# EAGLE design serial_to_usb_interface_0.2 (EAGLE 6.5.3)
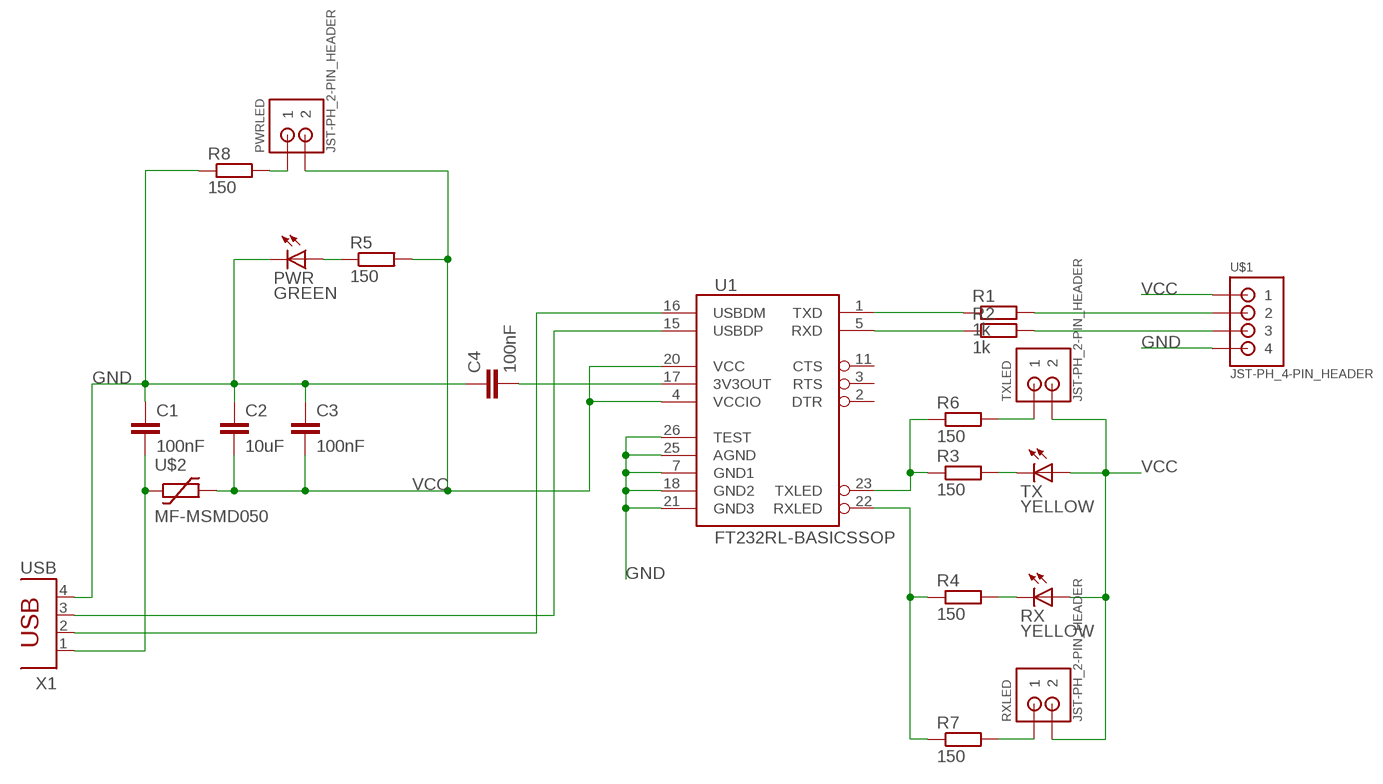
[diagram p0: schematic, sheet 1]

## Parts
C1  100nF  C-EUC1206  [C1206]
C2  10uF  C-EUC1206  [C1206]
C3  100nF  C-EUC1206  [C1206]
C4  100nF  C-EUC1206  [C1206]
PWR  GREEN  LEDCHIPLED_0805  [CHIPLED_0805]
PWRLED  JST-PH_2-PIN_HEADER  [JST_B2B-PH_HEADER]
R1  1k  R-EU_R1206  [R1206]
R2  1k  R-EU_R1206  [R1206]
R3  150  R-EU_R1206  [R1206]
R4  150  R-EU_R1206  [R1206]
R5  150  R-EU_R1206  [R1206]
R6  150  R-EU_R1206  [R1206]
R7  150  R-EU_R1206  [R1206]
R8  150  R-EU_R1206  [R1206]
RX  YELLOW  LEDCHIPLED_0805  [CHIPLED_0805]
RXLED  JST-PH_2-PIN_HEADER  [JST_B2B-PH_HEADER]
TX  YELLOW  LEDCHIPLED_0805  [CHIPLED_0805]
TXLED  JST-PH_2-PIN_HEADER  [JST_B2B-PH_HEADER]
U1  FT232RL-BASICSSOP  [SSOP28DB]
U$1  JST-PH_4-PIN_HEADER  [JST_B4B-PH_HEADER]
U$2  MF-MSMD050  [MF-MSMD050]
X1  USB  PN87520  [PN87520]

## Nets
GND: C1.1 C2.1 C3.1 C4.1 PWR.C R8.1 U1.7(GND1) U1.18(GND2) U1.21(GND3) U1.25(AGND) U1.26(TEST) U$1.P4 X1.4
N$2: R4.2 RX.C
N$3: R3.1 R6.1 U1.23(TXLED)
N$4: C4.2 U1.17(3V3OUT)
N$5: U1.15(USBDP) X1.3
N$6: U1.16(USBDM) X1.2
N$7: C1.2 U$2.P$1 X1.1
N$8: R1.1 U1.1(TXD)
N$9: R2.1 U1.5(RXD)
N$10: R1.2 U$1.P2
N$11: R2.2 U$1.P3
N$12: R4.1 R7.1 U1.22(RXLED)
N$15: R3.2 TX.C
N$16: R7.2 RXLED.P1
N$17: PWR.A R5.1
PWRLED: PWRLED.P1 R8.2
TXLED: R6.2 TXLED.P1
VCC: C2.2 C3.2 PWRLED.P2 R5.2 RX.A RXLED.P2 TX.A TXLED.P2 U1.4(VCCIO) U1.20(VCC) U$1.P1 U$2.P$2
Unconnected: U1.2(DTR) U1.3(RTS) U1.11(CTS)

## Library data of the parts
C1-C4 = resistor:C-EU: CAPACITOR, European symbol
PWR RX TX = adafruit:LED: LED OSRAM: - CHIPLED LG R971, LG N971, LY N971, LG Q971, LY Q971, LO R971, LY R971 LH N974, LH R974 LS Q976, LO Q976, LY Q976 LO Q996 - Hyper CHIPLED LW Q18S LB Q993, LB Q99A, LB R99A - SideLED LS A670, LO A670, LY A670, LG A670, LP A670 LB A673, LV A673, LT A673, LW A673 LH A674 LY A675 LS A676, LA A676, LO A676, LY A676, LW A676 LS A679, LY A679, LG A679 - Hyper Micro SIDELED® LS Y876, LA Y876, LO Y876, LY Y876 LT Y87S - SmartLED LW L88C, LW L88S LB L89C, LB L89S, LG L890 LS L89K, LO L89K, LY L89K LS L896, LA L896, LO L896, LY L896 - TOPLED LS T670, LO T670, LY T670, LG T670, LP T670 LSG T670, LSP T670, LSY T670, LOP T670, LYG T670 LG T671, LOG T671, LSG T671 LB T673, LV T673, LT T673, LW T673 LH T674 LS T676, LA T676, LO T676, LY T676, LB T676, LH T676, LSB T676, LW T676 LB T67C, LV T67C, LT T67C, LS T67K, LO T67K, LY T67K, LW E67C LS E67B, LA E67B, LO E67B, LY E67B, LB E67C, LV E67C, LT E67C LW T67C LS T679, LY T679, LG T679 LS T770, LO T770, LY T770, LG T770, LP T770 LB T773, LV T773, LT T773, LW T773 LH T774 LS E675, LA E675, LY E675, LS T675 LS T776, LA T776, LO T776, LY T776, LB T776 LHGB T686 LT T68C, LB T68C - Hyper Mini TOPLED® LB M676 - Mini TOPLED Santana® LG M470 LS M47K, LO M47K, LY M47K Source: http://www.osram.convergy.de/
PWRLED RXLED TXLED = SRG:JST-PH_2-PIN_HEADER: 2-pin JST PH Shrouded Header, top entry P/N B2B-PH-K-S Mating connector PHR-2 Mating cable assembly: Sparkfun PRT-09914 <http://www.sparkfun.com/products/9914>
R1-R8 = resistor:R-EU_: RESISTOR, European symbol
U1 = SparkFun-DigitalIC:FT232RL-BASIC: USB UART This is the simplified version of the FT232RL unit. Only what you need, nothing you don't. Spark Fun Electronics SKU : COM-00650
U$1 = SRG:JST-PH_4-PIN_HEADER: 4-pin JST PH Shrouded Header, top entry P/N B4B-PH-K-S Mating connector PHR-4 Mating cable assembly: Sparkfun PRT-09916 <http://www.sparkfun.com/products/9916>
U$2 = ptc-littlefuse:MF-MSMD050
X1 = con-berg:PN87520: BERG USB connector; OC_FARNELL: unknown; OC_NEWARK: unknown

## Board
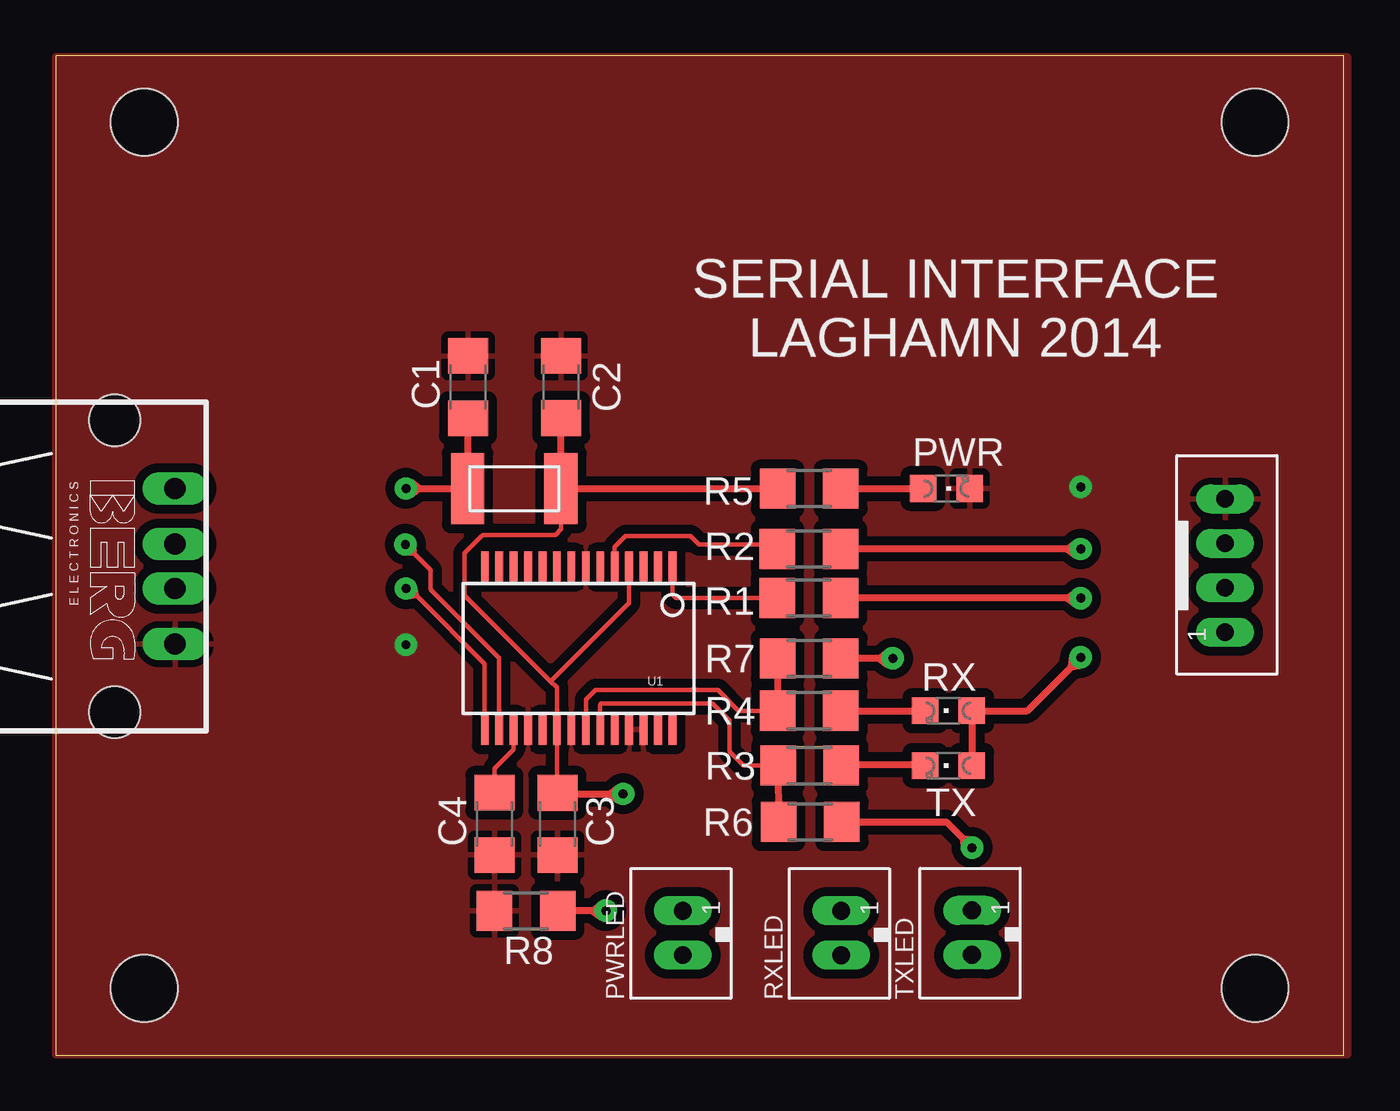
[diagram p1: board, top side]
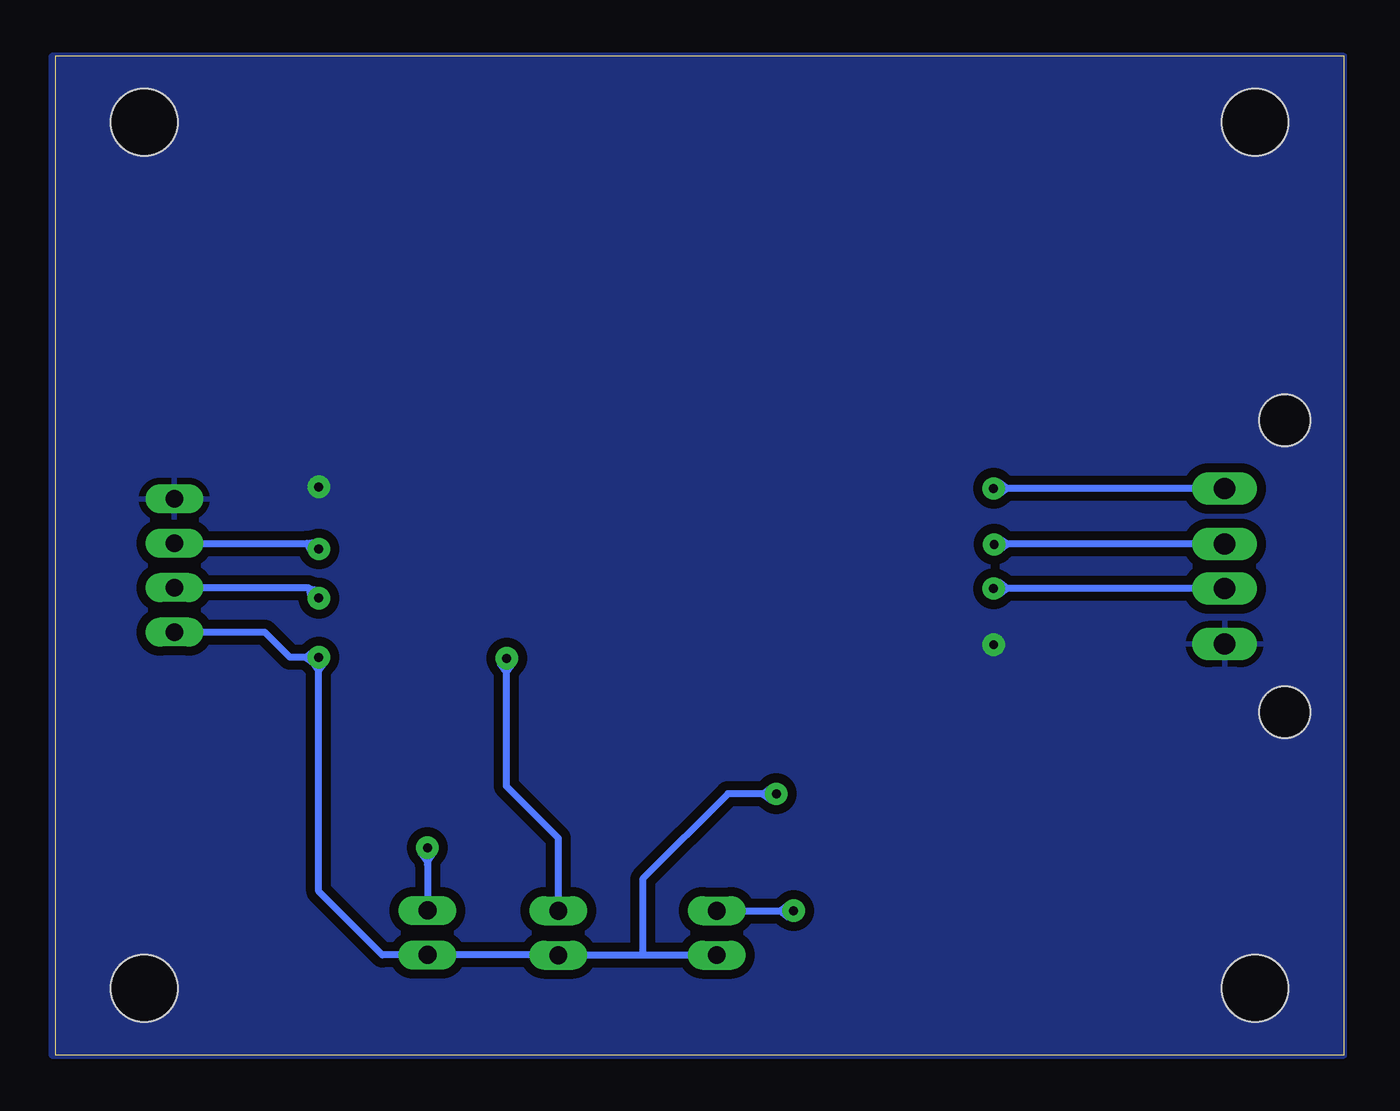
[diagram p2: board, bottom side, seen from below]

Size 58 x 45 mm. Coordinates in mm from the lower left corner, seen from the top.
Outline: 0,0 58,0 58,45 0,45 0,0
Copper layers (1*16): Top 0.035mm / dielectric 1.5mm / Bottom 0.035mm
Design rules "DesignRule *": minimum track width 8mil, minimum drill 0.5mm, track to track 16mil, track to pad 12mil, pad to pad 10mil, via to via 10mil, smd to smd 8mil, copper to edge 0mil, drill to drill 8mil, minimum pad ring 10mil, minimum via ring 12mil, stop-mask expansion 4mil, vias tented up to drill 0mil, thermal gap 12mil
Holes 3 mm at 4,3 4,42 54,42 54,3

### Footprints (pad centres in the part's own frame; a part is rotated, then mirrored left to right if it is on the bottom)
C1206 = smd 1.6 x 1.8: 1 -1.4,0; 2 1.4,0
CHIPLED_0805 = smd 1.2 x 1.2: A 0,-1.05; C 0,1.05
JST_B2B-PH_HEADER = drill 0.8 long: P1 1.075,0.048; P2 -0.925,0.048
R1206 = smd 1.6 x 1.803: 1 -1.422,0; 2 1.422,0
SSOP28DB = smd 0.348 x 1.397: 1 -4.225,-3.656; 2 -3.575,-3.656; 3 -2.925,-3.656; 4 -2.275,-3.656; 5 -1.625,-3.656; 6 -0.975,-3.656; 7 -0.325,-3.656; 8 0.325,-3.656; 9 0.975,-3.656; 10 1.625,-3.656; 11 2.275,-3.656; 12 2.925,-3.656; 13 3.575,-3.656; 14 4.225,-3.656; 15 4.225,3.656; 16 3.575,3.656; 17 2.925,3.656; 18 2.275,3.656; 19 1.625,3.656; 20 0.975,3.656; 21 0.325,3.656; 22 -0.325,3.656; 23 -0.975,3.656; 24 -1.625,3.656; 25 -2.275,3.656; 26 -2.925,3.656; 27 -3.575,3.656; 28 -4.225,3.656
JST_B4B-PH_HEADER = drill 0.8 long: P1 2.98,0.048; P2 0.98,0.048; P3 -1.02,0.048; P4 -3.02,0.048
MF-MSMD050 = smd 1.5 x 3.2: P$1 -2.1,0; P$2 2.1,0
PN87520 = drill 0.95 long: 1 -3.5,2.71; 2 -1,2.71; 3 1,2.71; 4 3.5,2.71 | hole 2.3: -6.57,0; 6.57,0

### Placement (x,y rotation side)
C1  18.56,30.07 270 top
C2  22.76,30.08 270 top
C3  22.59,10.4 90 top
C4  19.76,10.41 90 top
PWR  40.1,25.51 270 top
PWRLED  28.28,5.42 90 top
R1  33.92,20.58 0 top
R2  33.92,22.79 0 top
R3  33.95,13.03 0 top
R4  33.93,15.5 0 top
R5  33.92,25.5 180 top
R6  33.98,10.5 0 top
R7  33.93,17.86 0 top
R8  21.18,6.5 0 top
RX  40.19,15.5 90 top
RXLED  35.41,5.42 90 top
TX  40.19,13.03 90 top
TXLED  41.3,5.44 90 top
U1  23.55,18.31 180 top
U$1  52.6,22.02 270 top
U$2  20.65,25.5 0 top
X1  2.67,22 270 top

### Tracks (layer width: path | path; a pad name or v marks a point on that pad's centre or on a via)
GND  (via drill 0.4)
  other vias: 15.77,18.47 46.15,25.58
  pour Bottom (isolate 0.305): 0,45 58,45 58,0 0,0
  pour Top (isolate 0.305): 0,45 58,45 58,0 0,0
N$2
  Top 0.305: RX.C 39.12,15.49 35.43,15.49 R4.2
N$3
  Top 0.203: U1.23 24.51,14.68 24.51,15.77 24.56,15.82 29.57,15.82 30.33,15.06 30.33,13.66 30.96,13.03 R3.1
  Top 0.305: R3.1 R6.1
N$4
  Top 0.203: C4.2 19.76,12.9 20.62,13.76 U1.17
  Top 0.305: U1.17
N$5  (via drill 0.4)
  Top 0.203: v15.77,21.01 15.93,21.01 16.27,20.67 | 16.27,20.67 19.32,17.62 U1.15 | 16.27,20.67 16.16,21.1 v15.77,21.01 | 16.27,20.67 15.83,20.61 v15.77,21.01
  Bottom 0.203: v15.77,21 v15.77,21.01
  Bottom 0.305: X1.3 15.17,21 | 15.17,21 v15.77,21 | 15.17,21 15.57,20.72 v15.77,21.01 15.57,21.29 15.17,21
N$6  (via drill 0.4)
  Top 0.203: v15.75,22.99 16.17,22.56 | 16.17,22.56 16.89,21.84 16.89,20.95 19.97,17.88 U1.16 | 16.17,22.56 16.15,23.01 v15.75,22.99 | 16.17,22.56 15.73,22.58 v15.75,22.99
  Bottom 0.203: 15.77,23.01 15.77,23 15.75,23 v15.75,22.99
  Bottom 0.305: X1.2 15.15,23 | 15.15,23 15.75,23 | 15.15,23 15.53,22.71 v15.75,22.99 15.55,23.28 15.15,23
N$7  (via drill 0.4)
  Top 0.305: v15.78,25.51 16.38,25.51 | 16.38,25.51 U$2.P$1 18.56,25.5 C1.2 | 16.38,25.51 15.98,25.79 v15.78,25.51 | 16.38,25.51 15.98,25.22 v15.78,25.51
  Bottom 0.305: X1.1 15.18,25.5 | 15.18,25.5 v15.78,25.5 v15.78,25.51 | 15.18,25.5 15.57,25.22 v15.78,25.51 | 15.18,25.5 15.57,25.79 v15.78,25.51
N$8
  Top 0.203: R1.1 32.38,20.57 27.94,20.57 27.77,20.74 U1.1
N$9
  Top 0.203: R2.1 32.38,22.99 28.96,22.99 28.57,23.37 25.65,23.37 25.17,22.89 U1.5
N$10  (via drill 0.4)
  Top 0.305: v46.15,20.57 45.55,20.57 | 45.55,20.57 R1.2 | 45.55,20.57 45.95,20.29 v46.15,20.57 | 45.55,20.57 45.95,20.86 v46.15,20.57
  Bottom 0.305: U$1.P2 46.62,21.04 46.58,21 | 46.58,21 v46.15,20.57 | 46.58,21 46.1,20.92 v46.15,20.57 | 46.58,21 46.5,20.52 v46.15,20.57
N$11  (via drill 0.4)
  Top 0.203: R2.2
  Top 0.305: v46.15,22.78 45.55,22.78 | 45.55,22.78 R2.2 | 45.55,22.78 45.95,22.5 v46.15,22.78 | 45.55,22.78 45.95,23.07 v46.15,22.78
  Bottom 0.203: 46.41,23.04 v46.15,22.78
  Bottom 0.305: U$1.P3 46.69,23.04 | 46.69,23.04 46.41,23.04 | 46.69,23.04 46.22,23.13 v46.15,22.78 46.46,22.61 46.69,23.04
N$12
  Top 0.203: U1.22 23.88,14.68 23.88,16 24.31,16.43 29.82,16.43 30.75,15.5 R4.1
  Top 0.305: R7.1 32.51,17.78 32.51,15.62 R4.1
N$13
  pour Bottom: 0,0 0,44.96 58.17,44.96 58.17,0
N$14
  pour Top: 0,0 0,44.96 58.17,44.96 58.17,0
N$15
  Top 0.305: TX.C 39.12,13.08 35.43,13.08 R3.2
N$16  (via drill 0.4)
  Top 0.305: v37.69,17.86 37.09,17.86 | 37.09,17.86 36.94,17.86 | 36.94,17.86 R7.2 | 36.94,17.86 | 37.09,17.86 37.48,17.57 v37.69,17.86 | 37.09,17.86 37.48,18.14 v37.69,17.86
  Bottom 0.305: RXLED.P1 35.36,9.76 37.7,12.1 37.7,17.26 | 37.7,17.26 37.7,17.84 v37.69,17.86 | 37.7,17.26 37.98,17.66 v37.69,17.86 | 37.7,17.26 37.41,17.64 v37.69,17.86
N$17
  Top 0.305: R5.1 PWR.A
PWRLED  (via drill 0.4)
  Top 0.305: v24.77,6.5 24.18,6.5 | 24.18,6.5 24.02,6.5 | 24.02,6.5 R8.2 | 24.02,6.5 | 24.18,6.5 24.57,6.21 v24.77,6.5 | 24.18,6.5 24.57,6.78 v24.77,6.5
  Bottom 0.305: PWRLED.P1 25.38,6.5 | 25.38,6.5 25.16,6.5 v24.77,6.5 | 25.38,6.5 24.98,6.78 v24.77,6.5 | 25.38,6.5 24.98,6.21 v24.77,6.5
TXLED  (via drill 0.4)
  Top 0.305: R6.2 40.09,10.5 40.84,9.76 | 40.84,9.76 v41.26,9.33 | 40.84,9.76 40.91,9.28 v41.26,9.33 | 40.84,9.76 41.31,9.68 v41.26,9.33
  Bottom 0.305: v41.26,9.33 41.26,8.73 | 41.26,8.73 41.26,8.58 | 41.26,8.58 TXLED.P1 | 41.26,8.58 | 41.26,8.73 41.55,9.12 v41.26,9.33 | 41.26,8.73 40.98,9.12 v41.26,9.33
VCC  (via drill 0.4)
  Top 0.203: 22.29,16.83 18.41,20.7 18.41,22.61 19.18,23.37 19.25,23.42 22.5,23.42 22.76,23.67 22.76,25.38 U$2.P$2 | 22.61,14.73 U1.20 | 22.29,16.83 25.82,20.36 U1.4 | U1.20 22.58,14.55 22.58,12.45 22.59,12.45 C3.2 | 22.29,16.83 22.57,16.55 U1.20
  Top 0.305: 25.83,21.97 U1.4 | C3.2 22.63,11.76 24.95,11.76 | 41.27,15.49 RX.A | 41.27,15.49 RX.A TX.A | 24.95,11.76 v25.55,11.76 | 41.27,15.49 43.74,15.49 45.73,17.48 | 45.73,17.48 v46.15,17.91 | C2.2 22.76,25.5 U$2.P$2 R5.2 | 24.95,11.76 25.34,11.47 v25.55,11.76 | 24.95,11.76 25.34,12.04 v25.55,11.76 | 45.73,17.48 46.21,17.56 v46.15,17.91 | 45.73,17.48 45.8,17.96 v46.15,17.91
  Bottom 0.305: v25.55,11.76 26.15,11.76 | 26.15,11.76 27.74,11.76 31.57,7.92 31.57,4.5 | PWRLED.P2 31.57,4.5 | 31.57,4.5 RXLED.P2 35.38,4.51 TXLED.P2 43.3,4.51 46.15,7.37 46.15,17.31 | v46.15,17.91 46.75,17.91 | 46.75,17.91 47.45,17.91 48.58,19.04 U$1.P1 | 46.15,17.31 v46.15,17.91 | 26.15,11.76 25.76,12.04 v25.55,11.76 | 26.15,11.76 25.76,11.47 v25.55,11.76 | 46.75,17.91 46.36,18.19 v46.15,17.91 | 46.75,17.91 46.36,17.62 v46.15,17.91 | 46.15,17.31 46.44,17.7 v46.15,17.91 | 46.15,17.31 45.87,17.7 v46.15,17.91

### Text on the board
tDocu: GND | RX | TX | VCC
_tsilk: SERIAL INTERFACE / LAGHAMN 2014